# Altium schematic sheet Interface.SchDoc
size A3; Author: Alptron AB; CompanyName: Alptron AB; DrawnBy: Caner Alp; Engineer: Caner Alp; Organization: Alptron AB; Address2: Vaesteas; Address4: Sweden; DocumentNumber: 4; SheetNumber: 4; SheetTotal: 5
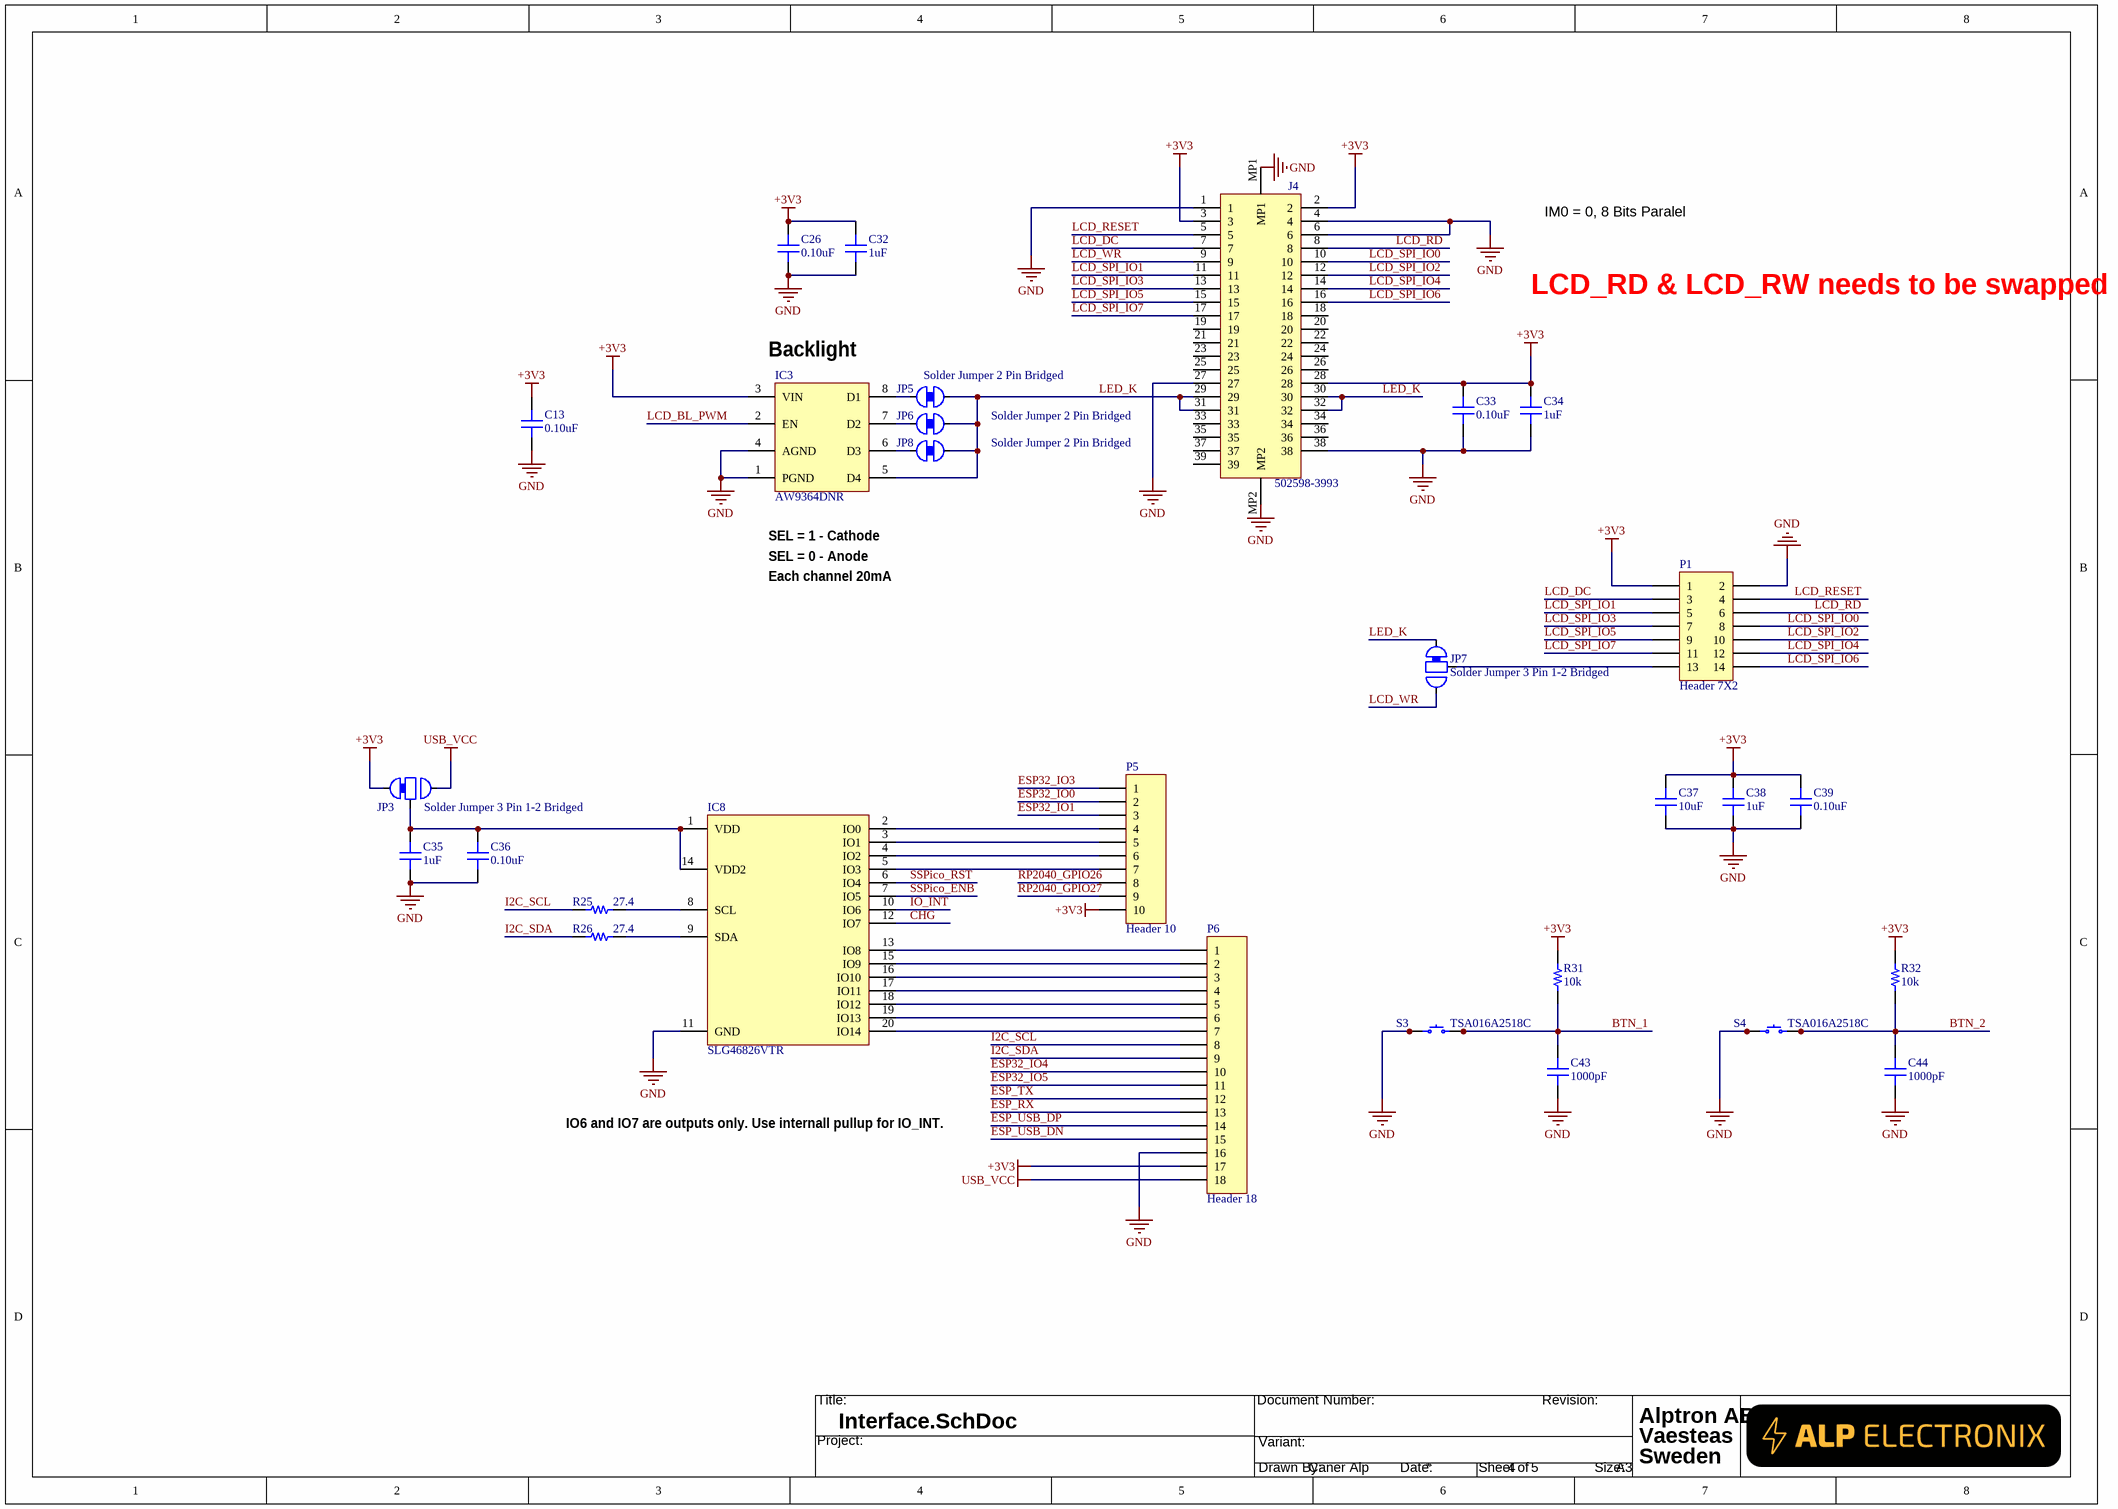
[diagram p0: Interface.SchDoc]

## Parts
C13  0.10uF  [CAP 0402/1005]
C26  0.10uF  [CAP 0402/1005]
C32  1uF  [CAP 0402/1005]
C33  0.10uF  [CAP 0402/1005]
C34  1uF  [CAP 0402/1005]
C35  1uF  [CAP 0402/1005]
C36  0.10uF  [CAP 0402/1005]
C37  10uF  [CAP 0603/1608]
C38  1uF  [CAP 0402/1005]
C39  0.10uF  [CAP 0402/1005]
C43  1000pF  [CAP 0402/1005]
C44  1000pF  [CAP 0402/1005]
IC3  AW9364DNR  [MAXIM TDFN-8 2x2MM]
IC8  SLG46826VTR  [SLG46826VTR]
J4  502598-3993  [5025983993]
JP3  Solder Jumper 3 Pin 1-2 Bridged  [SolderJumper-3_P1.3mm_Bridged12_RoundedPad1.0x1.5mm]  (net tie, no BOM)
JP5  Solder Jumper 2 Pin Bridged  [SolderJumper-2_P1.3mm_Bridged_RoundedPad1.0x1.5mm]  (net tie, no BOM)
JP6  Solder Jumper 2 Pin Bridged  [SolderJumper-2_P1.3mm_Bridged_RoundedPad1.0x1.5mm]  (net tie, no BOM)
JP7  Solder Jumper 3 Pin 1-2 Bridged  [SolderJumper-3_P1.3mm_Bridged12_RoundedPad1.0x1.5mm]  (net tie, no BOM)
JP8  Solder Jumper 2 Pin Bridged  [SolderJumper-2_P1.3mm_Bridged_RoundedPad1.0x1.5mm]  (net tie, no BOM)
P1  Header 7X2  [HDR2X7]
P5  Header 10  [Female Header 2.54mm - 10 Pin]
P6  Header 18  [Female Header 2.54mm - 18 Pin]
R25  27.4  [RES 0402/1005]
R26  27.4  [RES 0402/1005]
R31  10k  [RES 0402/1005]
R32  10k  [RES 0402/1005]
S3  TSA016A2518C  [TSA016A2518C]
S4  TSA016A2518C  [TSA016A2518C]

## Nets
+3V3: C13.2 C26.2 C32.2 C33.2 C34.2 C37.2 C38.2 C39.2 IC3.3(VIN) J4.2 J4.3 J4.28 JP3.1(A) P1.1 P5.10 P6.17 R31.2 R32.2
GND: C13.1 C26.1 C32.1 C33.1 C34.1 C35.1 C36.1 C37.1 C38.1 C39.1 C43.1 C44.1 IC3.1(PGND) IC3.4(AGND) IC8.11(GND) J4.1 J4.4 J4.6 J4.27 J4.38 J4.MP1 J4.MP2 P1.2 P6.16 S3.1 S3.2 S4.1 S4.2
USB_VCC: JP3.3(B) P6.18
BTN_1: C43.2 R31.1 S3.3 S3.4
BTN_2: C44.2 R32.1 S4.3 S4.4
CHG: IC8.12(IO7)
ESP32_IO0: P5.2
ESP32_IO1: P5.3
ESP32_IO3: P5.1
ESP32_IO4: P6.10
ESP32_IO5: P6.11
ESP_RX: P6.13
ESP_TX: P6.12
ESP_USB_DN: P6.15
ESP_USB_DP: P6.14
I2C_SCL: P6.8 R25.1
I2C_SDA: P6.9 R26.1
IO_INT: IC8.10(IO6)
LCD_BL_PWM: IC3.2(EN)
LCD_DC: J4.7 P1.3
LCD_RD: J4.8 P1.6
LCD_RESET: J4.5 P1.4
LCD_SPI_IO0: J4.10 P1.8
LCD_SPI_IO1: J4.11 P1.5
LCD_SPI_IO2: J4.12 P1.10
LCD_SPI_IO3: J4.13 P1.7
LCD_SPI_IO4: J4.14 P1.12
LCD_SPI_IO5: J4.15 P1.9
LCD_SPI_IO6: J4.16 P1.14
LCD_SPI_IO7: J4.17 P1.11
LCD_WR: J4.9 JP7.3(B)
LED_K: IC3.5(D4) J4.29 J4.30 J4.31 J4.32 JP5.2(B) JP6.2(B) JP7.1(A) JP8.2(B)
RP2040_GPIO26: P5.8
RP2040_GPIO27: P5.9
SSPico_ENB: IC8.7(IO5)
SSPico_RST: IC8.6(IO4)
NetC35_2: C35.2 C36.2 IC8.1(VDD) IC8.14(VDD2) JP3.2(C)
NetIC3_6: IC3.6(D3) JP8.1(A)
NetIC3_7: IC3.7(D2) JP6.1(A)
NetIC3_8: IC3.8(D1) JP5.1(A)
NetIC8_2: IC8.2(IO0) P5.4
NetIC8_3: IC8.3(IO1) P5.5
NetIC8_4: IC8.4(IO2) P5.6
NetIC8_5: IC8.5(IO3) P5.7
NetIC8_8: IC8.8(SCL) R25.2
NetIC8_9: IC8.9(SDA) R26.2
NetIC8_13: IC8.13(IO8) P6.1
NetIC8_15: IC8.15(IO9) P6.2
NetIC8_16: IC8.16(IO10) P6.3
NetIC8_17: IC8.17(IO11) P6.4
NetIC8_18: IC8.18(IO12) P6.5
NetIC8_19: IC8.19(IO13) P6.6
NetIC8_20: IC8.20(IO14) P6.7
NetJP7_2: JP7.2(C) P1.13

Not connected (* = marked no-connect by the designer): J4 18 19 20 21 22 23 24 25 26 33 34 35 36 37 39

## Notes on the sheet
- IM0 = 0, 8 Bits Paralel
- LCD_RD & LCD_RW needs to be swapped
- (near IC3) Backlight
- SEL = 0 - Anode
- (near IC3) SEL = 1 - Cathode
- Each channel 20mA
- IO6 and IO7 are outputs only. Use internall pullup for IO_INT.
- Title:
- Project:
- Document Number:
- Variant:
- Revision:
- Drawn By:
- Date:
- Sheet
- of
- Size:
- A3

## Library data of the parts
C13 C26 C33 C36 C39 = LMK105BJ104KV-F: CAP CER 0.1UF 10V X5R 0402; Manufacturer: Taiyo Yuden; TemperatureRange: -55C ~ 85C; Tolerance: 10%; Value: 0.10uF; Part Number: LMK105BJ104KV-F; PartId: 12322; Supplier 1: Digi-Key; Supplier Part Number 1: 587-1227-2-ND; ComponentLink1Description: Datasheet; ComponentLink1URL: http://ds.yuden.co.jp/TYCOMPAS/ut/detail.do?productNo=LMK105BJ104KV-F&fileName=LMK105BJ104KV-F_SS&mode=specSheetDownload; ComponentLink2Description: Digi-Key Listing; ComponentLink2URL: https://www.digikey.com/product-detail/en/taiyo-yuden/LMK105BJ104KV-F/587-1227-2-ND/930579; TemperatureCoefficient: X5R; Voltage: 10V; Price: 0,0021; Device Package: 0402 (1005 Metric)
C32 C34 C35 C38 = GRM155R70J105KA12D: CAP CER 1UF 6.3V X7R 0402; Manufacturer: Murata Electronics North America; TemperatureRange: -55C ~ 125C; Tolerance: 10%; Type: Derating Recommended; Value: 1uF; Part Number: GRM155R70J105KA12D; PartId: 5157; Supplier 1: Digi-Key; Supplier Part Number 1: 490-10024-2-ND; ComponentLink1Description: Datasheet; ComponentLink1URL: http://www.murata.com/~/media/webrenewal/support/library/catalog/products/capacitor/mlcc/c02e.ashx; ComponentLink2Description: Digi-Key listing; ComponentLink2URL: http://digikey.com/product-detail/en/GRM155R70J105KA12D/490-10024-2-ND/5027109; TemperatureCoefficient: X7R; Voltage: 6.3V; Price: 0,019; Device Package: 0402 (1005 Metric)
C37 = GRM188R60J106ME47D: CAP CER 10UF 6.3V X5R 0603; Manufacturer: Murata Electronics North America; TemperatureRange: -55C ~ 85C; Tolerance: 20%; Value: 10uF; Part Number: GRM188R60J106ME47D; PartId: 12950; Supplier 1: Digi-Key; Supplier Part Number 1: 490-3896-2-ND; ComponentLink1Description: Datasheet; ComponentLink1URL: http://www.murata.com/~/media/webrenewal/support/library/catalog/products/capacitor/mlcc/c02e.pdf; ComponentLink2Description: Digi-Key Listing; ComponentLink2URL: https://www.digikey.com/product-detail/en/murata-electronics-north-america/GRM188R60J106ME47D/490-3896-2-ND/965910; TemperatureCoefficient: X5R; Voltage: 6.3V; Price: 0,031; Device Package: 0603 (1608 Metric)
C43 C44 = C1005C0G1H102J050BA: CAP CER 1000PF 50V C0G 0402; Manufacturer: TDK Corporation; TemperatureRange: -55C ~ 125C; TemperatureCoefficient: C0G, NP0; Tolerance: 5%; Value: 1000pF; Part Number: C1005C0G1H102J050BA; PartId: 3861; Supplier 1: Digi-Key; Supplier Part Number 1: 445-6846-2-ND; ComponentLink1Description: Datasheet; ComponentLink1URL: https://product.tdk.com/info/en/catalog/datasheets/mlcc_commercial_general_en.pdf; ComponentLink2Description: Digi-Key listing; ComponentLink2URL: http://digikey.com/product-detail/en/C1005C0G1H102J050BA/445-6846-2-ND/2619187; Voltage: 50V; Price: 0,0287; Type: -; Device Package: 0402 (1005 Metric)
IC3 = AW9364DNR: -40℃~+85℃ DFN-8(2x2) LED Drivers ROHS
IC8 = SLG46826VTR: Programmable Mixed Signal Matrix with In-System Programmability 2.048kHz/2.048MHz/25MHz Oscillators 20-Pin STQFN; Manufacturer_Name: Dialog Semiconductor; Manufacturer: Renesas; Datasheet Link: https://componentsearchengine.com/Datasheets/2/SLG46826VTR.pdf; Height: 0.6mm; Manufacturer_Part_Number: SLG46826VTR; Mouser Part Number: 724-SLG46826VTR; Mouser Price/Stock: https://www.mouser.co.uk/ProductDetail/Dialog-Semiconductor/SLG46826VTR?qs=w%2Fv1CP2dgqrVTrYCw9J2sA%3D%3D; Supplier 1: Farnell; Manufacturer Part Number: SLG46826V; RoHS: No; Category: CPLDs - Complex Programming Logic Devices; Stock 1: 3286; Pricing 1: 1=15,12000, 10=12,82000, 50=10,78000, 100=8,74000, 250=8,51000, 500=8,27000, 1000=6,43000, 2500=6,11000 (SEK)
J4 = 502598-3993: Connector; Manufacturer_Name: Molex; Datasheet Link: https://www.molex.com/pdm_docs/sd/5025983993_sd.pdf; Height: 1.63mm; Manufacturer_Part_Number: 502598-3993; Mouser Part Number: 538-502598-3993; Mouser Price/Stock: https://www.mouser.co.uk/ProductDetail/Molex/502598-3993?qs=yd8XiKYcH9m2CHpgP0wV0A%3D%3D
JP3 JP7 = SolderJumper_3_Bridged12: ki_keywords: Solder Jumper SPDT; ki_description: 3-pole Solder Jumper, pins 1+2 closed/bridged; ki_fp_filters: SolderJumper*Bridged12*; Supplier: ~
JP5 JP6 JP8 = SolderJumper_2_Bridged: ki_keywords: solder jumper SPST; ki_description: Solder Jumper, 2-pole, closed/bridged; ki_fp_filters: SolderJumper*Bridged*; Supplier: ~
P1 = Header 7X2: Header, 7-Pin, Dual row; LatestRevisionDate: 17-Jul-2002; LatestRevisionNote: Re-released for DXP Platform.; Publisher: Altium Limited
P5 = Header 10: Header, 10-Pin; LatestRevisionDate: 17-Jul-2002; LatestRevisionNote: Re-released for DXP Platform.; Publisher: Altium Limited
P6 = Header 18: Header, 18-Pin; LatestRevisionDate: 17-Jul-2002; LatestRevisionNote: Re-released for DXP Platform.; Publisher: Altium Limited
R25 R26 = ERJ-2RKF27R4X: RES SMD 27.4 OHM 1% 1/10W 0402; Manufacturer: Panasonic Electronic Components; TemperatureRange: -55C ~ 155C; TemperatureCoefficient: 100ppm/C; PowerRating: 0.1W, 1/10W; Value: 27.4; Part Number: ERJ-2RKF27R4X; PartId: 342; Supplier 1: Digi-Key; Supplier Part Number 1: P27.4LTR-ND; ComponentLink1Description: Datasheet; ComponentLink1URL: http://industrial.panasonic.com/www-cgi/jvcr13pz.cgi?E+PZ+3+AOA0002+ERJ2RKF27R4X+7+WW; ComponentLink2Description: Digikey listing; ComponentLink2URL: http://digikey.com/product-detail/en/ERJ-2RKF27R4X/P27.4LTR-ND/192262; Tolerance: 1%; Price: 0,0043; Type: Thick Film; Device Package: 0402 (1005 Metric)
R31 R32 = RC0402JR-0710KL: RES SMD 10K OHM 5% 1/16W 0402; Manufacturer: Yageo; TemperatureRange: -55C ~ 155C; TemperatureCoefficient: 100ppm/C; PowerRating: 0.063W, 1/16W; Value: 10k; Part Number: RC0402JR-0710KL; PartId: 14464; Supplier 1: Digi-Key; Supplier Part Number 1: 311-10KJRTR-ND; ComponentLink1Description: Datasheet; ComponentLink1URL: http://www.yageo.com/documents/recent/PYu-RC_Group_51_RoHS_L_04.pdf; ComponentLink2Description: Digi-Key Listing; ComponentLink2URL: https://www.digikey.com/product-detail/en/yageo/RC0402JR-0710KL/311-10KJRTR-ND/726418; Tolerance: 5%; Price: 0,0017; Device Package: 0402 (1005 Metric)
S3 S4 = PTS810 SJM 250 SMTR LFS: SWITCH TACTILE SPST-NO 0.05A 16V; Manufacturer: C&K; Actuator Height off PCB, Vertical: 2.50mm; Actuator Orientation: Top Actuated; Actuator Type: Oval Button; Contact Rating @ Voltage: 0.05A @ 16VDC; Illumination: Non-Illuminated; Operating Force: 160gf; Outline: 4.20mm x 3.20mm; Switch Function: Off-Mom; Part Number: TSA016A2518C; Circuit: SPST-NO; ComponentLink1Description: Datasheet; ComponentLink1URL: https://dznh3ojzb2azq.cloudfront.net/products/Tactile/PTS810/documents/datasheet.pdf; ComponentLink2Description: DigiKey Link; ComponentLink2URL: http://digikey.com/product-detail/en/c-k/PTS810-SJM-250-SMTR-LFS/CKN10502CT-ND/4176673; LastUpdated: 2020-04-09 10:00:13; Lifecycle Status: Active; Minimum Order: 1; Mounting Type: Surface Mount; Operating Temperature: -40°C ~ 85°C; Packaging: TapeAndReel; Part Status: Active; Price: 0.16; Series: PTS810; Supplier 1: DigiKey; Supplier Part Number 1: CKN10502CT-ND; Termination Style: J Lead